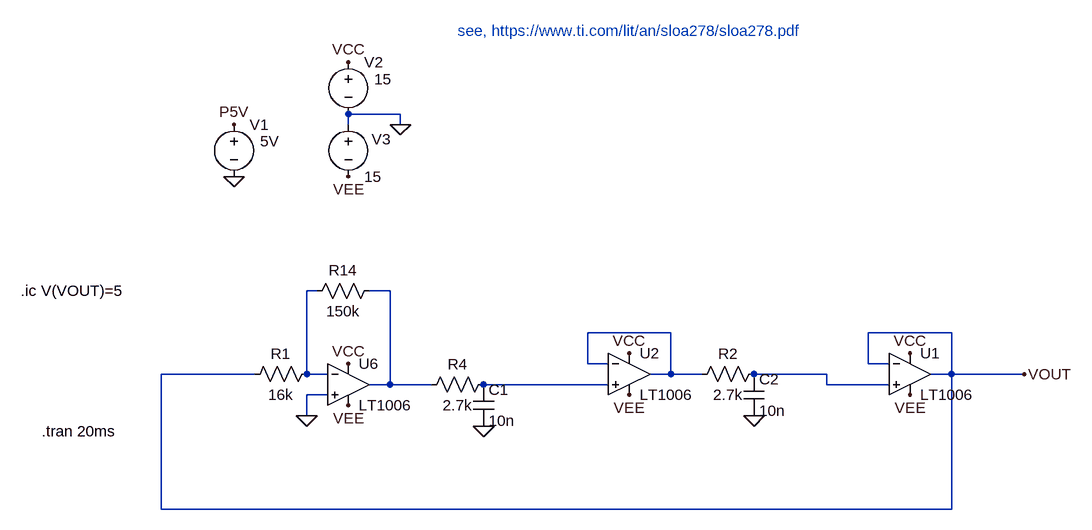
[diagram p0: schematic Draft01.asc]
Draft01.asc, the LTspice schematic file:
Version 4
SHEET 1 2720 868
WIRE -496 -112 -576 -112
WIRE -576 -96 -576 -112
WIRE -496 -96 -496 -112
WIRE -624 160 -640 160
WIRE -512 160 -544 160
WIRE -80 224 -208 224
WIRE 352 224 224 224
WIRE -208 272 -208 224
WIRE -176 272 -208 272
WIRE 224 272 224 224
WIRE 256 272 224 272
WIRE -720 288 -864 288
WIRE -640 288 -640 160
WIRE -608 288 -640 288
WIRE -80 288 -80 224
WIRE -80 288 -112 288
WIRE -32 288 -80 288
WIRE 160 288 48 288
WIRE 352 288 352 224
WIRE 352 288 320 288
WIRE 464 288 352 288
WIRE -512 304 -512 160
WIRE -512 304 -544 304
WIRE -448 304 -512 304
WIRE -176 304 -368 304
WIRE 160 304 160 288
WIRE 256 304 160 304
WIRE -608 320 -640 320
WIRE -640 352 -640 320
WIRE -864 496 -864 288
WIRE 352 496 352 288
WIRE 352 496 -864 496
FLAG -496 -96 0
FLAG -576 -192 VCC
FLAG -576 -16 VEE
FLAG -752 -96 P5V
FLAG -752 -16 0
FLAG -640 352 0
FLAG -576 272 VCC
FLAG -576 336 VEE
FLAG -368 368 0
FLAG 288 256 VCC
FLAG 288 320 VEE
FLAG 464 288 VOUT
FLAG -144 256 VCC
FLAG -144 320 VEE
FLAG 48 352 0
SYMBOL voltage -576 -208 R0
WINDOW 123 0 0 Left 0
WINDOW 39 0 0 Left 0
WINDOW 3 40 42 Left 2
SYMATTR Value 15
SYMATTR InstName V2
SYMBOL voltage -576 -112 R0
WINDOW 123 0 0 Left 0
WINDOW 39 0 0 Left 0
WINDOW 0 36 39 Left 2
SYMATTR InstName V3
SYMATTR Value 15
SYMBOL voltage -752 -112 R0
WINDOW 123 0 0 Left 0
WINDOW 39 0 0 Left 0
WINDOW 3 40 42 Left 2
SYMATTR Value 5V
SYMATTR InstName V1
SYMBOL OpAmps\\LT1006 -576 240 R0
SYMATTR InstName U6
SYMBOL res -624 272 R90
WINDOW 0 0 56 VBottom 2
WINDOW 3 32 56 VTop 2
SYMATTR InstName R1
SYMATTR Value 16k
SYMBOL res -528 144 R90
WINDOW 0 0 56 VBottom 2
WINDOW 3 32 56 VTop 2
SYMATTR InstName R14
SYMATTR Value 150k
SYMBOL res -352 288 R90
WINDOW 0 0 56 VBottom 2
WINDOW 3 32 56 VTop 2
SYMATTR InstName R4
SYMATTR Value 2.7k
SYMBOL cap -384 304 R0
SYMATTR InstName C1
SYMATTR Value 10n
SYMBOL OpAmps\\LT1006 288 224 R0
SYMATTR InstName U1
SYMBOL OpAmps\\LT1006 -144 224 R0
SYMATTR InstName U2
SYMBOL res 64 272 R90
WINDOW 0 0 56 VBottom 2
WINDOW 3 32 56 VTop 2
SYMATTR InstName R2
SYMATTR Value 2.7k
SYMBOL cap 32 288 R0
SYMATTR InstName C2
SYMATTR Value 10n
TEXT -1048 376 Left 2 !.tran 20ms
TEXT -1080 160 Left 2 !.ic V(VOUT)=5
TEXT -408 -240 Left 2 ;see, https://www.ti.com/lit/an/sloa278/sloa278.pdf

The netlist it stands for:
* Draft01.asc
V2 VCC 0 15
V3 0 VEE 15
V1 P5V 0 5V
XU6 0 N001 VCC VEE N002 LT1006  ; pins In+ In- V+ V- OUT
R1 N001 VOUT 16k
R14 N002 N001 150k
R4 N005 N002 2.7k
C1 N005 0 10n
XU1 N004 VOUT VCC VEE VOUT LT1006  ; pins In+ In- V+ V- OUT
XU2 N005 N003 VCC VEE N003 LT1006  ; pins In+ In- V+ V- OUT
R2 N004 N003 2.7k
C2 N004 0 10n
.tran 20ms
.ic V(VOUT)=5
* see, https://www.ti.com/lit/an/sloa278/sloa278.pdf
.lib LTC.lib
.backanno
.end